# EAGLE design Drum Machine LCD Backlight (EAGLE 5.07)
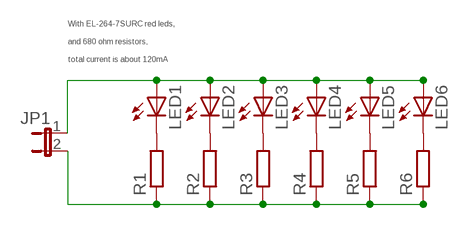
[diagram p0: schematic, sheet 1]

## Parts
JP1  JP1E  [JP1]
LED1  LED3MM  [LED3MM]
LED2  LED3MM  [LED3MM]
LED3  LED3MM  [LED3MM]
LED4  LED3MM  [LED3MM]
LED5  LED3MM  [LED3MM]
LED6  LED3MM  [LED3MM]
R1  R-EU_0207/7  [0207/7]
R2  R-EU_0207/7  [0207/7]
R3  R-EU_0207/7  [0207/7]
R4  R-EU_0207/7  [0207/7]
R5  R-EU_0207/7  [0207/7]
R6  R-EU_0207/7  [0207/7]

## Nets
N$1: LED1.K(C) R1.2
N$2: LED2.K(C) R2.2
N$3: LED3.K(C) R3.2
N$4: LED4.K(C) R4.2
N$5: LED5.K(C) R5.2
N$6: LED6.K(C) R6.2
N$7: JP1.1 LED1.A LED2.A LED3.A LED4.A LED5.A LED6.A
N$8: JP1.2 R1.1 R2.1 R3.1 R4.1 R5.1 R6.1

## Notes on the sheet
- With EL-264-7SURC red leds,
- and 680 ohm resistors,
- total current is about 120mA

## Library data of the parts
JP1 = jumper:JP1E: JUMPER
LED1-LED6 = led:LED: LED OSRAM: - CHIPLED LG R971, LG N971, LY N971, LG Q971, LY Q971, LO R971, LY R971 LH N974, LH R974 LS Q976, LO Q976, LY Q976 LO Q996 - Hyper CHIPLED LW Q18S LB Q993, LB Q99A, LB R99A - SideLED LS A670, LO A670, LY A670, LG A670, LP A670 LB A673, LV A673, LT A673, LW A673 LH A674 LY A675 LS A676, LA A676, LO A676, LY A676, LW A676 LS A679, LY A679, LG A679 - Hyper Micro SIDELED® LS Y876, LA Y876, LO Y876, LY Y876 LT Y87S - SmartLED LW L88C, LW L88S LB L89C, LB L89S, LG L890 LS L89K, LO L89K, LY L89K LS L896, LA L896, LO L896, LY L896 - TOPLED LS T670, LO T670, LY T670, LG T670, LP T670 LSG T670, LSP T670, LSY T670, LOP T670, LYG T670 LG T671, LOG T671, LSG T671 LB T673, LV T673, LT T673, LW T673 LH T674 LS T676, LA T676, LO T676, LY T676, LB T676, LH T676, LSB T676, LW T676 LB T67C, LV T67C, LT T67C, LS T67K, LO T67K, LY T67K, LW E67C LS E67B, LA E67B, LO E67B, LY E67B, LB E67C, LV E67C, LT E67C LW T67C LS T679, LY T679, LG T679 LS T770, LO T770, LY T770, LG T770, LP T770 LB T773, LV T773, LT T773, LW T773 LH T774 LS E675, LA E675, LY E675, LS T675 LS T776, LA T776, LO T776, LY T776, LB T776 LHGB T686 LT T68C, LB T68C - Hyper Mini TOPLED® LB M676 - Mini TOPLED Santana® LG M470 LS M47K, LO M47K, LY M47K Source: http://www.osram.convergy.de LUXEON: - LUMILED® LXK2-PW12-R00, LXK2-PW12-S00, LXK2-PW14-U00, LXK2-PW14-V00 LXK2-PM12-R00, LXK2-PM12-S00, LXK2-PM14-U00 LXK2-PE12-Q00, LXK2-PE12-R00, LXK2-PE12-S00, LXK2-PE14-T00, LXK2-PE14-U00 LXK2-PB12-K00, LXK2-PB12-L00, LXK2-PB12-M00, LXK2-PB14-N00, LXK2-PB14-P00, LXK2-PB14-Q00 LXK2-PR12-L00, LXK2-PR12-M00, LXK2-PR14-Q00, LXK2-PR14-R00 LXK2-PD12-Q00, LXK2-PD12-R00, LXK2-PD12-S00 LXK2-PH12-R00, LXK2-PH12-S00 LXK2-PL12-P00, LXK2-PL12-Q00, LXK2-PL12-R00 Source: www.luxeon.com KINGBRIGHT: KA-3528ASYC Source: www.kingbright.com
R1-R6 = resistor:R-EU_: RESISTOR, European symbol

## Board
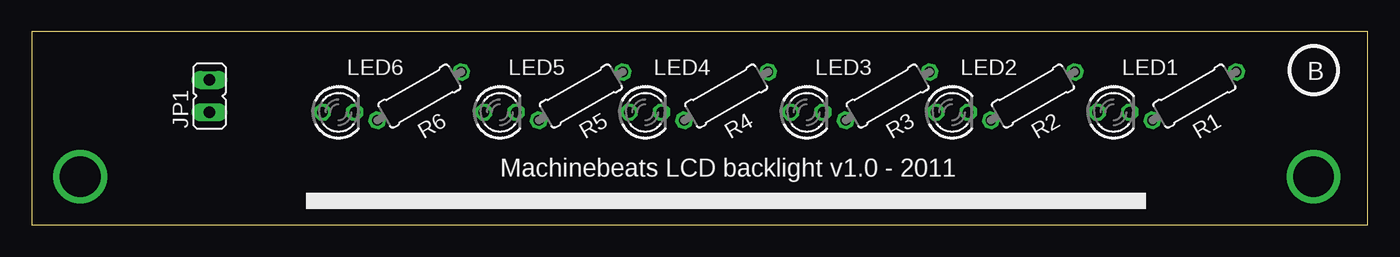
[diagram p1: board, top side]
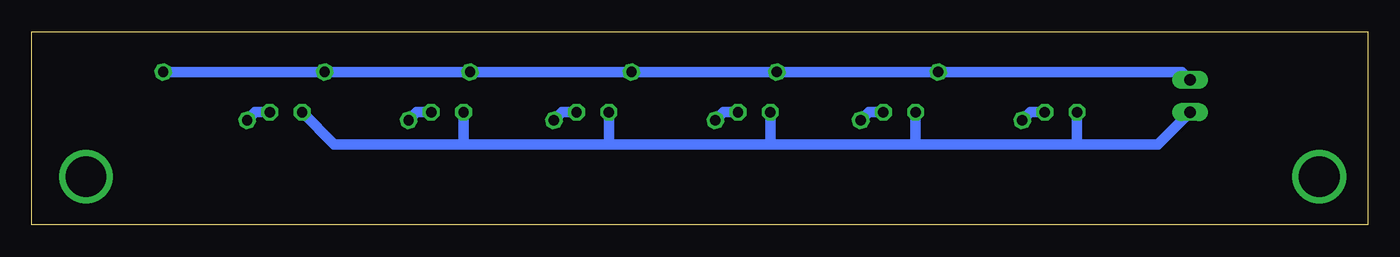
[diagram p2: board, bottom side, seen from below]

Size 105.08 x 15.23 mm. Coordinates in mm from the lower left corner, seen from the top.
Outline: 0,0 105.08,0 105.08,15.23 0,15.23 0,0
Copper layers (1*16): Top 0.035mm / dielectric 1.5mm / Bottom 0.035mm
Design rules "10mils": minimum track width 10mil, minimum drill 24mil, track to track 10mil, track to pad 10mil, pad to pad 10mil, via to via 10mil, smd to smd 10mil, copper to edge 40mil, drill to drill 10mil, minimum pad ring 10mil, minimum via ring 8mil, stop-mask expansion 0mil, vias tented up to drill 0mil, thermal gap 10mil

### Footprints (pad centres in the part's own frame; a part is rotated, then mirrored left to right if it is on the bottom)
JP1 = drill 0.914 long: 1 0,-1.27; 2 0,1.27
LED3MM = drill 0.813 octagon: A -1.27,0; K 1.27,0
0207/7 = drill 0.813 octagon: 1 -3.81,0; 2 3.81,0

### Placement (x,y rotation side)
JP1  13.97,10.16 0 top
LED1  85.09,8.89 0 top
LED2  72.39,8.89 0 top
LED3  60.96,8.89 0 top
LED4  48.26,8.89 0 top
LED5  36.83,8.89 0 top
LED6  24.13,8.89 0 top
R1  91.44,10.16 210 top
R2  78.74,10.16 210 top
R3  67.31,10.16 210 top
R4  54.61,10.16 210 top
R5  43.18,10.16 210 top
R6  30.48,10.16 210 top

### Tracks (layer width: path | path; a pad name or v marks a point on that pad's centre or on a via)
N$1
  Bottom 0.813: LED1.K 87.5,8.89 R1.2
N$2
  Bottom 0.813: LED2.K 74.81,8.89 R2.2
N$3
  Bottom 0.813: LED3.K 63.38,8.89 R3.2
N$4
  Bottom 0.813: LED4.K 50.67,8.89 R4.2
N$5
  Bottom 0.813: LED5.K 39.24,8.89 R5.2
N$6
  Bottom 0.813: LED6.K 26.55,8.89 R6.2
N$7
  Bottom 0.813: JP1.1 16.51,6.35 22.86,6.35 | 22.86,6.35 35.56,6.35 | 35.56,6.35 46.99,6.35 | 46.99,6.35 59.69,6.35 | 59.69,6.35 71.12,6.35 | 71.12,6.35 81.28,6.35 LED1.A | 22.86,6.35 LED6.A | 35.56,6.35 LED5.A | 46.99,6.35 LED4.A | 59.69,6.35 LED3.A | 71.12,6.35 LED2.A
N$8
  Bottom 0.813: R1.1 R2.1 R3.1 R4.1 R5.1 R6.1 14.61,12.06 JP1.2
N$9  (via drill 3.2)
  other vias: 3.81,3.81
N$10  (via drill 3.2)
  other vias: 100.81,3.81

### Text on the board
tPlace: B | Machinebeats LCD backlight v1.0 - 2011